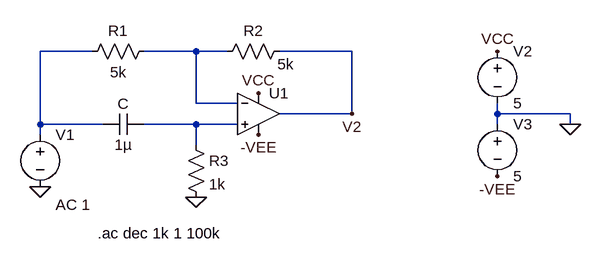
[diagram p0: schematic Filtro Pasa Todo.asc]
Filtro Pasa Todo.asc, the LTspice schematic file:
Version 4
SHEET 1 880 680
WIRE 64 48 -16 48
WIRE 224 48 144 48
WIRE 272 48 224 48
WIRE 464 48 352 48
WIRE 224 128 224 48
WIRE 288 128 224 128
WIRE 464 144 464 48
WIRE 464 144 352 144
WIRE 688 144 688 128
WIRE 800 144 688 144
WIRE -16 160 -16 48
WIRE 80 160 -16 160
WIRE 224 160 144 160
WIRE 288 160 224 160
WIRE 688 160 688 144
WIRE 800 160 800 144
WIRE -16 176 -16 160
WIRE 224 192 224 160
FLAG 688 48 VCC
FLAG 688 240 -VEE
FLAG 800 160 0
FLAG 320 112 VCC
FLAG 320 176 -VEE
FLAG 224 272 0
FLAG -16 256 0
FLAG 464 144 V2
SYMBOL res 208 176 R0
SYMATTR InstName R3
SYMATTR Value 1k
SYMBOL cap 144 144 R90
WINDOW 0 0 32 VBottom 2
WINDOW 3 32 32 VTop 2
SYMATTR InstName C
SYMATTR Value 1µ
SYMBOL res 368 32 R90
WINDOW 0 0 56 VBottom 2
WINDOW 3 20 6 VTop 2
SYMATTR InstName R2
SYMATTR Value 5k
SYMBOL res 160 32 R90
WINDOW 0 0 56 VBottom 2
WINDOW 3 32 56 VTop 2
SYMATTR InstName R1
SYMATTR Value 5k
SYMBOL OpAmps\\UniversalOpamp2 320 144 R0
SYMATTR InstName U1
SYMBOL voltage -16 160 R0
WINDOW 123 24 124 Left 2
WINDOW 39 0 0 Left 0
SYMATTR InstName V1
SYMATTR Value ""
SYMATTR Value2 AC 1
SYMBOL voltage 688 32 R0
WINDOW 123 0 0 Left 0
WINDOW 39 0 0 Left 0
SYMATTR InstName V2
SYMATTR Value 5
SYMBOL voltage 688 144 R0
WINDOW 123 0 0 Left 0
WINDOW 39 0 0 Left 0
SYMATTR InstName V3
SYMATTR Value 5
TEXT 72 328 Left 2 !.ac dec 1k 1 100k

The netlist it stands for:
* Filtro Pasa Todo.asc
R3 N003 0 1k
C N003 N001 1µ
R2 V2 N002 5k
R1 N002 N001 5k
XU1 N003 N002 VCC -VEE V2 level.2 Avol=1Meg GBW=10Meg Slew=10Meg ilimit=25m rail=0 Vos=0 phimargin=45 en=0 enk=0 in=0 ink=0 Rin=500Meg  ; pins IN+ IN- V+ V- OUT
V1 N001 0 AC 1
V2 VCC 0 5
V3 0 -VEE 5
.ac dec 1k 1 100k
.lib UniversalOpamps2.sub
.backanno
.end